# EasyEDA Pro project CH32V307.eprj

# Schematic CH32V307
Board Name: CH32V307; Create Date: 2025-04-24; Page Name: Core; Project Name: CH32V307; Schematic Name: CH32V307; Update Date: 2025-04-25; Company: My Company; Drawed: XIVN1987; Page Size: A4; Version: V1.0
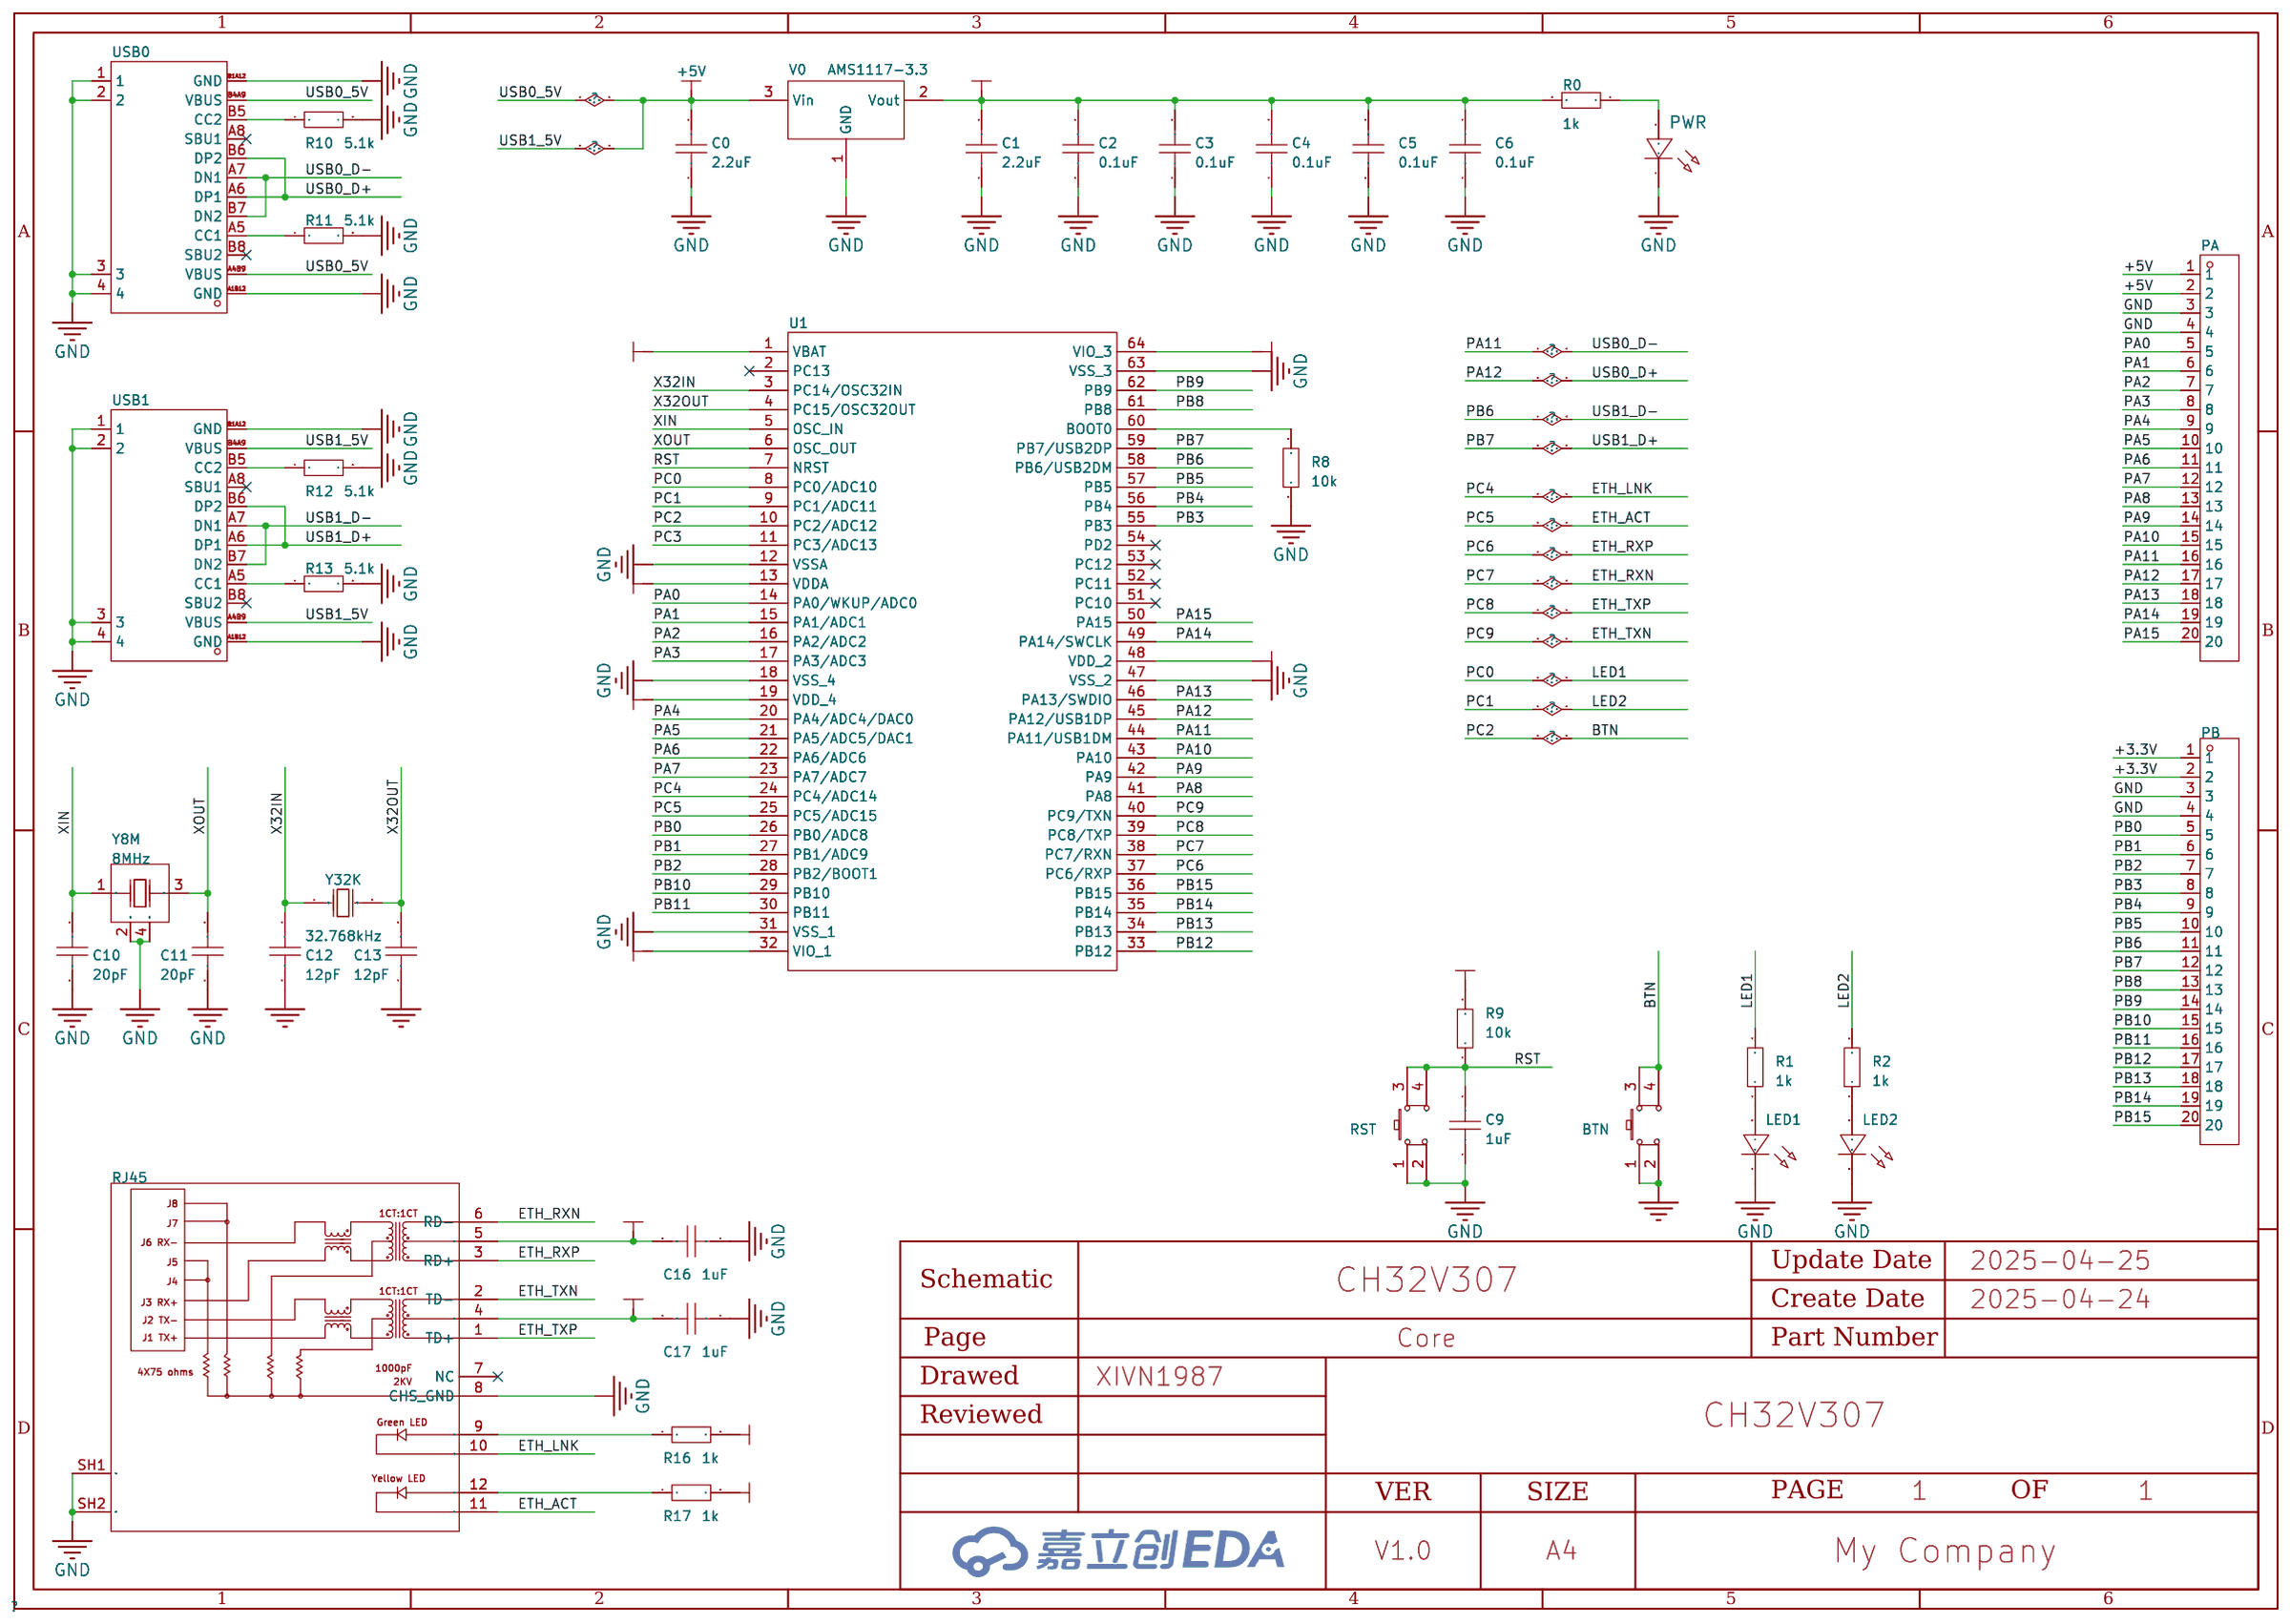
[diagram p0: schematic sheet]

## Parts
BTN  PTS815SJK250SMTRLFS  [SW-SMD_4P-L4.2-W3.3-P2.15-LS5.1]
C0  2.2uF  [C0603]
C1  2.2uF  [C0603]
C2  0.1uF  [C0603]
C3  0.1uF  [C0603]
C4  0.1uF  [C0603]
C5  0.1uF  [C0603]
C6  0.1uF  [C0603]
C9  1uF  [C0603]
C10  20pF  [C0603]
C11  20pF  [C0603]
C12  12pF  [C0603]
C13  12pF  [C0603]
C16  1uF  [C0603]
C17  1uF  [C0603]
LED1  -  [LED0603-RD_BLUE]
LED2  -  [LED0603-RD_BLUE]
PA  -  [HDR-TH_20P-P2.54-V-M-1]
PB  -  [HDR-TH_20P-P2.54-V-M-1]
PWR  -  [LED0603-RD_BLUE]
R0  1k  [R0603]
R1  1k  [R0603]
R2  1k  [R0603]
R8  10k  [R0603]
R9  10k  [R0603]
R10  5.1k  [R0603]
R11  5.1k  [R0603]
R12  5.1k  [R0603]
R13  5.1k  [R0603]
R16  1k  [R0603]
R17  1k  [R0603]
RJ45  HR911105A  [RJ45-TH_HR911105A]
RST  PTS815SJK250SMTRLFS  [SW-SMD_4P-L4.2-W3.3-P2.15-LS5.1]
U1  -  [LQFP-64_L10.0-W10.0-P0.50-LS12.0-TL]
USB0  USB-TYPE-C-017  [USB-TYPE-C-SMD_C9900008089]
USB1  USB-TYPE-C-017  [USB-TYPE-C-SMD_C9900008089]
V0  AMS1117-3.3  [SOT-89-3_L4.5-W2.5-P1.50-LS4.2-BR]
Y8M  8MHz  [OSC-SMD_4P-L3.2-W2.5-BL]
Y32K  32.768kHz  [OSC-SMD_L3.2-W1.5]

## Library data of the parts
BTN RST = PTS815SJK250SMTRLFS: 操作寿命10万次，使用温度-20°C 至 70°C,尺寸4.20mmx3.20mmx2.50mm，操作力度2.5N; LCSC Part Name: 轻触开关; Supplier Part: C918859; Manufacturer: CK; Supplier Footprint: SMD; JLCPCB Part Class: 扩展库; Datasheet: https://atta.szlcsc.com/upload/public/pdf/source/20190916/C411883_4F77F16E1D8E48DC707D8949CEE7CF80.pdf; Supplier: LCSC
C0-C6 C9-C13 C16 C17 = CAP_0603: 容值:100nF;精度:±10%;额定电压:50V;温度系数:X7R;; Supplier Footprint: 0603
LED1 LED2 = LED_0603-B: 照明颜色:蓝色;主波长/色坐标:465~475nm;; Supplier Footprint: 0603; Supplier Part: C72041
PA PB = HDR-M_2.54_1x20P: 间距:2.54mm;总PIN位数:20;排数:1;插针结构:-;行距:-;安装类型:直插;圆针/方针:-;额定电流:-;额定电压:-;配合针长度:-;塑高:-;触头材质:黄铜;触头镀层:-;颜色:黑色;; Supplier Part: C50981; Supplier Footprint: 插件
PWR = LED_0603-R: 发光颜色:红灯;二极管配置:-;透镜颜色:无色透明;主波长:617.5nm;峰值波长:632nm;色温:-;光通量(25时):-;测试电流:5mA;正向电压(VF):2.2V;发光强度:28.5mcd;功率:60mW;发光角度:120°;安装方式:-;工作温度:-40~+85;; Supplier Footprint: 0603; Supplier Part: C72044
R0-R2 R8-R13 R16 R17 = Res_0603: Supplier Footprint: 0603
RJ45 = HR911105A_C12074: 连接器类型:RJ插座;USOC代码:RJ45;端口数量:1;等级:-;屏蔽:-;LED:带LED;; LCSC Part Name: RJ45 带LED; Supplier Part: C12074; Manufacturer: HANRUN(汉仁); Supplier Footprint: 插件; JLCPCB Part Class: 扩展库; Datasheet: https://atta.szlcsc.com/upload/public/pdf/source/20170918/C12074_1505726819496976146.pdf; Supplier: LCSC; Connector Type: RJ插座; Number of Ports: 1; LED: 带LED
U1 = CH32V307RC
USB0 USB1 = USB-TYPE-C-017: 连接器类型:Type-C;标准:-;公母:母座;触点数量:16;端口数量:1;安装方式:卧贴;额定电流 - 电源:3A;工作温度范围:-25~+85;; Supplier Part: C2927037; Manufacturer: DEALON(德艺隆); Supplier Footprint: SMD; JLCPCB Part Class: 扩展库; Datasheet: https://atta.szlcsc.com/upload/public/pdf/source/20211217/653222EE5174722C9DFE2966329956D8.pdf; Supplier: LCSC; Connector Type: Type-C; Gender: 母座; Number of Contacts: 16; Number of Ports: 1; Mounting Style: 卧贴; Current Rating - Power (Max): 3A; Operating Temperature Range: -25~+85
V0 = AMS1117-3.3_SOT-89: 输出类型:-;; Supplier Part: C880752; Manufacturer: Slkor(萨科微); Supplier Footprint: SOT-89-3; JLCPCB Part Class: 扩展库; Datasheet: https://atta.szlcsc.com/upload/public/pdf/source/20201231/C426566_7F22DB93439D00F3FA27143E4F28C6AA.pdf; Supplier: LCSC
Y8M = X322512MSB4SI: 晶振类型:贴片无源晶振;频率:12MHz;频率公差:±10ppm;频率稳定度:±30ppm;负载电容:20pF;工作温度:-40~+85;; LCSC Part Name: 12MHz ±10ppm 20pF; Supplier Part: C9002; Manufacturer: YXC(扬兴晶振); Supplier Footprint: SMD3225-4P; JLCPCB Part Class: 基础库; Datasheet: https://atta.szlcsc.com/upload/public/pdf/source/20210329/C112971_1F611BDC486E193C1706F6D8EB5AA189.pdf; Supplier: LCSC; Crystal Type: 贴片无源晶振; Frequency Tolerance: ±10ppm; Frequency Stability: ±30ppm; Load Capacitance: 20pF; Operating Temperature: -40~+85
Y32K = 7LC32768F12UC: 工作温度:-40~+85;工作温度:-40~+85;频率:32.768kHz;负载电容:12.5pF;晶振类型:贴片无源晶振;频率公差:±20ppm;频率公差:±20ppm;等效串联电阻(ESR):70kΩ;; LCSC Part Name: 32.768KHZ 12.5PF  ±20ppm; Supplier Part: C252398; Manufacturer: SJK(晶科鑫); Supplier Footprint: SMD-3215_2P; JLCPCB Part Class: 扩展库; Datasheet: https://atta.szlcsc.com/upload/public/pdf/source/20180725/C252398_B09721EBC402D2F46F4FCA4EBDD60A31.pdf; Supplier: LCSC; Operating Temperature: -40~+85; Load Capacitance: 12.5pF; Crystal Type: 贴片无源晶振; Frequency Tolerance: ±20ppm; Equivalent Series Resistance (ESR): 70kΩ

## Nets
+3.3V: C1.2 C2.2 C3.2 C4.2 C5.1 C6.1 C16.2 C17.2 PB.1 PB.2 R0.2 R9.2 R16.2 R17.2 RJ45.4 RJ45.5 U1.1(VBAT) U1.13(VDDA) U1.19(VDD_4) U1.32(VIO_1) U1.48(VDD_2) U1.64(VIO_3) V0.2(Vout)
+5V: C0.2 PA.1 PA.2 USB0.A4B9(VBUS) USB0.B4A9(VBUS) USB1.A4B9(VBUS) USB1.B4A9(VBUS) V0.3(Vin)
GND: BTN.1 BTN.2 C0.1 C1.1 C2.1 C3.1 C4.1 C5.2 C6.2 C9.1 C10.2 C11.1 C12.2 C13.1 C16.1 C17.1 LED1.1(C) LED2.1(C) PA.3 PA.4 PB.3 PB.4 PWR.1(C) R8.1 R10.2 R11.2 R12.2 R13.2 RJ45.8(CHS GND) RJ45.SH1 RJ45.SH2 RST.1 RST.2 U1.12(VSSA) U1.18(VSS_4) U1.31(VSS_1) U1.47(VSS_2) U1.63(VSS_3) USB0.1 USB0.2 USB0.3 USB0.4 USB0.A1B12(GND) USB0.B1A12(GND) USB1.1 USB1.2 USB1.3 USB1.4 USB1.A1B12(GND) USB1.B1A12(GND) V0.1(GND) Y8M.2(GND) Y8M.4(GND)
BTN: BTN.3 BTN.4 U1.10(PC2/ADC12)
ETH_ACT: RJ45.11 U1.25(PC5/ADC15)
ETH_LNK: RJ45.10 U1.24(PC4/ADC14)
ETH_RXN: RJ45.6(RD-) U1.38(PC7/RXN)
ETH_RXP: RJ45.3(RD+) U1.37(PC6/RXP)
ETH_TXN: RJ45.2(TD-) U1.40(PC9/TXN)
ETH_TXP: RJ45.1(TD+) U1.39(PC8/TXP)
LED1: R1.2 U1.8(PC0/ADC10)
LED2: R2.2 U1.9(PC1/ADC11)
PA0: PA.5 U1.14(PA0/WKUP/ADC0)
PA1: PA.6 U1.15(PA1/ADC1)
PA2: PA.7 U1.16(PA2/ADC2)
PA3: PA.8 U1.17(PA3/ADC3)
PA4: PA.9 U1.20(PA4/ADC4/DAC0)
PA5: PA.10 U1.21(PA5/ADC5/DAC1)
PA6: PA.11 U1.22(PA6/ADC6)
PA7: PA.12 U1.23(PA7/ADC7)
PA8: PA.13 U1.41(PA8)
PA9: PA.14 U1.42(PA9)
PA10: PA.15 U1.43(PA10)
PA11: PA.16 U1.44(PA11/USB1DM) USB0.A7(DN1) USB0.B7(DN2)
PA12: PA.17 U1.45(PA12/USB1DP) USB0.A6(DP1) USB0.B6(DP2)
PA13: PA.18 U1.46(PA13/SWDIO)
PA14: PA.19 U1.49(PA14/SWCLK)
PA15: PA.20 U1.50(PA15)
PB0: PB.5 U1.26(PB0/ADC8)
PB1: PB.6 U1.27(PB1/ADC9)
PB2: PB.7 U1.28(PB2/BOOT1)
PB3: PB.8 U1.55(PB3)
PB4: PB.9 U1.56(PB4)
PB5: PB.10 U1.57(PB5)
PB6: PB.11 U1.58(PB6/USB2DM) USB1.A7(DN1) USB1.B7(DN2)
PB7: PB.12 U1.59(PB7/USB2DP) USB1.A6(DP1) USB1.B6(DP2)
PB8: PB.13 U1.61(PB8)
PB9: PB.14 U1.62(PB9)
PB10: PB.15 U1.29(PB10)
PB11: PB.16 U1.30(PB11)
PB12: PB.17 U1.33(PB12)
PB13: PB.18 U1.34(PB13)
PB14: PB.19 U1.35(PB14)
PB15: PB.20 U1.36(PB15)
PC3: U1.11(PC3/ADC13)
RST: C9.2 R9.1 RST.3 RST.4 U1.7(NRST)
X32IN: C12.1 U1.3(PC14/OSC32IN) Y32K.1(OSC1)
X32OUT: C13.2 U1.4(PC15/OSC32OUT) Y32K.2(OSC2)
XIN: C10.1 U1.5(OSC_IN) Y8M.1(OSC1)
XOUT: C11.2 U1.6(OSC_OUT) Y8M.3(OSC2)
$1N2870: R11.1 USB0.A5(CC1)
$1N2871: R10.1 USB0.B5(CC2)
$1N2886: PWR.2(A) R0.1
$1N5367: R13.1 USB1.A5(CC1)
$1N5368: R12.1 USB1.B5(CC2)
$1N10227: R8.2 U1.60(BOOT0)
$1N26835: R16.1 RJ45.9
$1N26917: R17.1 RJ45.12
$1N39242: LED2.2(A) R2.1
$1N74940: LED1.2(A) R1.1

Not connected (* = marked no-connect by the designer): RJ45 7(NC)*; U1 2(PC13)* 51(PC10)* 52(PC11)* 53(PC12)* 54(PD2)*; USB0 A8(SBU1)* B8(SBU2)*; USB1 A8(SBU1)* B8(SBU2)*

# Board CH32V307
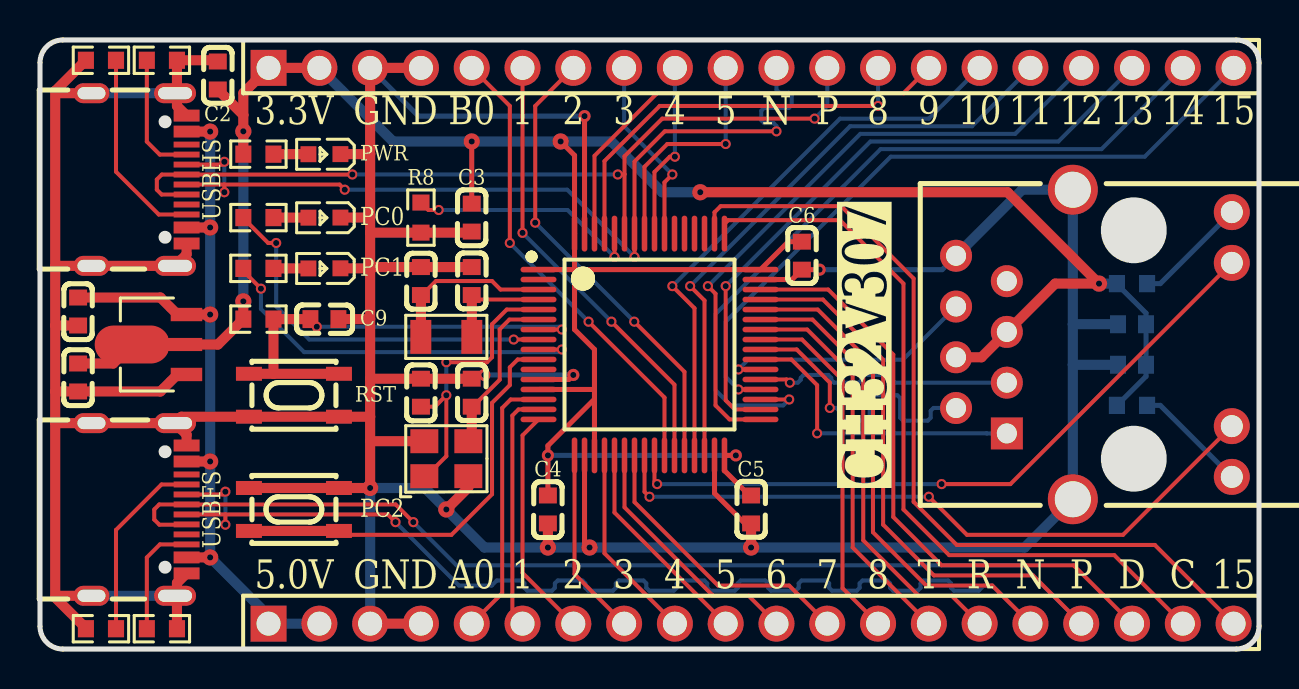
[diagram p1: board, top side]
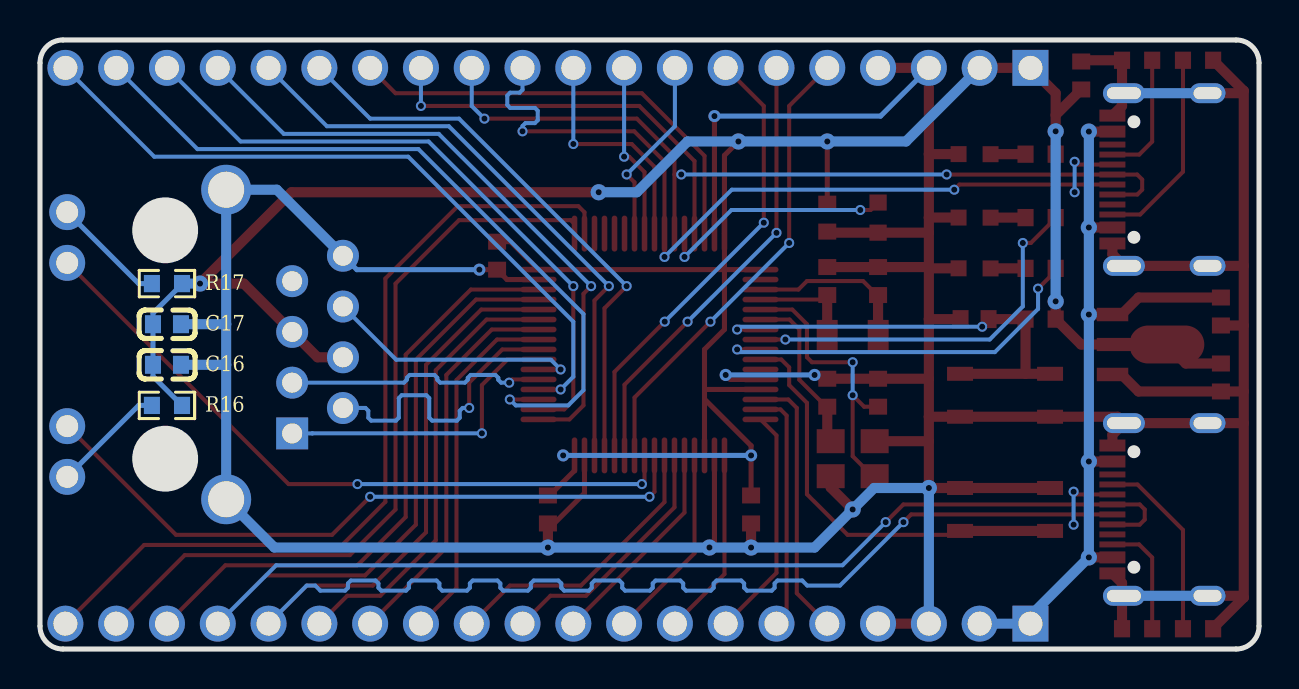
[diagram p2: board, bottom side, seen from below]

Outline 60.96 x 30.48 mm; copper layers: Top Layer, Bottom Layer. Coordinates in mm from the lower left corner of the outline.
Outline path: 0,29.34 0,1.14 arc(0.33,0.33) 1.14,0 59.82,0 arc(60.63,0.33) 60.96,1.14 60.96,29.34 arc(60.63,30.15) 59.82,30.48 1.14,30.48 arc(0.33,30.15) 0,29.34
Stack: Top Layer 0.035mm / Dielectric1 1.51mm FR4 er 4.5 / Bottom Layer 0.035mm

## Design rules (mm)
net PB7: USBHS
net PB6: USBHS
net PA12: USBFS
net PA11: USBFS
net ETH_TXN: ETHTX
net ETH_TXP: ETHTX
net ETH_RXN: ETHRX
net ETH_RXP: ETHRX
spacing safeClearance (default): track to track 0.152, other pairs 0.152 to 0.3
track width trackWidth (default): min 0.127, default 0.254, max 2.54
differential pair differentialPair (default): width min 0.127, default 0.254, max 2.54; gap min 0.152, default 0.152
via viaSize (default): diameter min 0.5, default 0.61, max 10; hole min 0.3, default 0.305, max 6

## Placement (name value [footprint] x y rotation side)
BTN  PTS815SJK250SMTRLFS  [SW-SMD_4P-L4.2-W3.3-P2.15-LS5.1]  12.7 6.98 0 top
C0  2.2uF  [C0603]  1.91 16.89 90 top
C1  2.2uF  [C0603]  1.91 13.59 90 top
C2  0.1uF  [C0603]  8.89 28.7 270 top
C3  0.1uF  [C0603]  21.59 21.59 90 top
C4  0.1uF  [C0603]  25.4 6.98 90 top
C5  0.1uF  [C0603]  35.56 6.98 270 top
C6  0.1uF  [C0603]  38.1 19.69 270 top
C9  1uF  [C0603]  14.22 16.51 180 top
C10  20pF  [C0603]  19.05 12.83 90 top
C11  20pF  [C0603]  21.59 12.83 270 top
C12  12pF  [C0603]  19.05 18.42 90 top
C13  12pF  [C0603]  21.59 18.42 270 top
C16  1uF  [C0603]  54.61 14.22 0 bottom
C17  1uF  [C0603]  54.61 16.26 0 bottom
LED1  -  [LED0603-RD_BLUE]  14.22 21.59 180 top
LED2  -  [LED0603-RD_BLUE]  14.22 19.05 180 top
PA  -  [HDR-TH_20P-P2.54-V-M-1]  35.56 1.27 0 top
PB  -  [HDR-TH_20P-P2.54-V-M-1]  35.56 29.08 0 top
PWR  -  [LED0603-RD_BLUE]  14.22 24.77 180 top
R0  1k  [R0603]  10.92 24.77 180 top
R1  1k  [R0603]  10.92 21.59 180 top
R2  1k  [R0603]  10.92 19.05 180 top
R8  10k  [R0603]  19.05 21.59 90 top
R9  10k  [R0603]  10.92 16.51 180 top
R10  5.1k  [R0603]  6.1 1.02 0 top
R11  5.1k  [R0603]  3.05 1.02 180 top
R12  5.1k  [R0603]  3.05 29.46 180 top
R13  5.1k  [R0603]  6.1 29.46 0 top
R16  1k  [R0603]  54.61 12.19 180 bottom
R17  1k  [R0603]  54.61 18.29 180 bottom
RJ45  HR911105A  [RJ45-TH_HR911105A]  52.71 15.24 90 top
RST  PTS815SJK250SMTRLFS  [SW-SMD_4P-L4.2-W3.3-P2.15-LS5.1]  12.7 12.7 180 top
U1  -  [LQFP-64_L10.0-W10.0-P0.50-LS12.0-TL]  30.48 15.24 0 top
USB0  USB-TYPE-C-017  [USB-TYPE-C-SMD_C9900008089]  4.95 6.98 270 top
USB1  USB-TYPE-C-017  [USB-TYPE-C-SMD_C9900008089]  4.95 23.5 270 top
V0  AMS1117-3.3  [SOT-89-3_L4.5-W2.5-P1.50-LS4.2-BR]  5.97 15.24 0 top
Y8M  8MHz  [OSC-SMD_4P-L3.2-W2.5-BL]  20.32 9.53 0 top
Y32K  32.768kHz  [OSC-SMD_L3.2-W1.5]  20.32 15.62 0 top

## Footprints (pads in the part's own frame, mm; a bottom-side part is the same pattern mirrored in y, then rotated)
C0603
  rect 0.8x0.9 smd: 1(-0.7,0) 2(0.7,0)
HDR-TH_20P-P2.54-V-M-1
  rect 1.801x1.801 hole 1.199: 1(-24.13,0)
  round 1.801 hole 1.199: 2(-21.59,0) 3(-19.05,0) 4(-16.51,0) 5(-13.97,0) 6(-11.43,0) 7(-8.89,0) 8(-6.35,0) 9(-3.81,0) 10(-1.27,0) 11(1.27,0) 12(3.81,0) 13(6.35,0) 14(8.89,0) 15(11.43,0) 16(13.97,0) 17(16.51,0) 18(19.05,0) 19(21.59,0) 20(24.13,0)
LED0603-RD_BLUE
  rect 0.8x0.8 smd: 1(-0.8,-0.003) 2(0.8,0.003)
LQFP-64_L10.0-W10.0-P0.50-LS12.0-TL
  oval 1.801x0.28 smd: 1(-5.55,3.749) 2(-5.55,3.251) 3(-5.55,2.751) 4(-5.55,2.251) 5(-5.55,1.75) 6(-5.55,1.25) 7(-5.55,0.75) 8(-5.55,0.249) 9(-5.55,-0.249) 10(-5.55,-0.75) 11(-5.55,-1.25) 12(-5.55,-1.75) 13(-5.55,-2.251) 14(-5.55,-2.751) 15(-5.55,-3.248) 16(-5.55,-3.749) 33(5.55,-3.749) 34(5.55,-3.248) 35(5.55,-2.751) 36(5.55,-2.251) 37(5.55,-1.75) 38(5.55,-1.25) 39(5.55,-0.75) 40(5.55,-0.249) 41(5.55,0.249) 42(5.55,0.75) 43(5.55,1.25) 44(5.55,1.75) 45(5.55,2.251) 46(5.55,2.751) 47(5.55,3.251) 48(5.55,3.749)
  oval 0.28x1.801 smd: 17(-3.749,-5.55) 18(-3.248,-5.55) 19(-2.751,-5.55) 20(-2.251,-5.55) 21(-1.75,-5.55) 22(-1.25,-5.55) 23(-0.75,-5.55) 24(-0.249,-5.55) 25(0.249,-5.55) 26(0.75,-5.55) 27(1.25,-5.55) 28(1.75,-5.55) 29(2.251,-5.55) 30(2.751,-5.55) 31(3.251,-5.55) 32(3.749,-5.55) 49(3.749,5.55) 50(3.251,5.55) 51(2.751,5.55) 52(2.251,5.55) 53(1.75,5.55) 54(1.25,5.55) 55(0.75,5.55) 56(0.249,5.55) 57(-0.249,5.55) 58(-0.75,5.55) 59(-1.25,5.55) 60(-1.75,5.55) 61(-2.251,5.55) 62(-2.751,5.55) 63(-3.248,5.55) 64(-3.749,5.55)
OSC-SMD_4P-L3.2-W2.5-BL
  rect 1.4x1.2 smd: 1(-1.1,-0.875) 2(1.1,-0.875) 3(1.1,0.875) 4(-1.1,0.875)
OSC-SMD_L3.2-W1.5
  rect 1.049x1.7 smd: 1(-1.275,0) 2(1.275,0)
R0603
  rect 0.806x0.864 smd: 1(-0.753,0) 2(0.753,0)
RJ45-TH_HR911105A
  rect 1.6x1.6 hole 1: 1(-4.45,4.355)
  round 1.6 hole 1: 2(-3.18,6.895) 3(-1.91,4.355) 4(-0.64,6.895) 5(0.63,4.355) 6(1.9,6.895) 7(3.17,4.355) 8(4.44,6.895)
  round 1.8 hole 1.1: 9(-6.625,-6.895) 10(-4.085,-6.895) 11(4.085,-6.895) 12(6.625,-6.895)
  round 2.5 hole 1.8: SH1(-7.745,1.055) SH2(7.745,1.055)
SOT-89-3_L4.5-W2.5-P1.50-LS4.2-BR
  rect 1.575x0.672 smd: 1(1.356,-1.5) 3(1.356,1.5)
  custom 5.377x1.9 smd: 2(-1.356,0)
SW-SMD_4P-L4.2-W3.3-P2.15-LS5.1
  rect 1.3x0.701 smd: 1(-2.251,1.075) 2(2.251,1.075) 3(-2.251,-1.075) 4(2.251,-1.075)
USB-TYPE-C-SMD_C9900008089
  oval 1x2.1 hole 0.6x1.7: 1(-4.32,1.801) 2(4.32,1.801)
  oval 1x1.8 hole 0.6x1.4: 3(-4.32,-2.379) 4(4.32,-2.379)
  rect 0.6x1.3 smd: A1B12(-3.2,2.379) A4B9(-2.4,2.379) B1A12(3.2,2.379) B4A9(2.4,2.379)
  rect 0.3x1.3 smd: A5(-1.25,2.379) A6(-0.25,2.379) A7(0.25,2.379) A8(1.25,2.379) B5(1.75,2.379) B6(0.75,2.379) B7(-0.75,2.379) B8(-1.75,2.379)

## Nets
As in the schematic.

Pads without a net: RJ45 7; U1 2 51 52 53 54; USB0 A8 B8; USB1 A8 B8

## Via types
v1: diameter 0.813, hole 0.305, Top Layer to Bottom Layer, 16 vias
v2: diameter 0.61, hole 0.305, Top Layer to Bottom Layer, 6 vias
v3: diameter 0.508, hole 0.305, Top Layer to Bottom Layer, 46 vias

## Routing (per net, layer and track width the routed paths; a pad name or vN(x,y) marks a point on that pad's centre or on a via; arc(x,y) is an arc through that point)
+3.3V: length 142.5
  Top Layer w0.254: C4.2 v2(25.4,9.69) 25.4,10.18 27.73,12.51 ; C3.2 v1(21.59,25.4) ; 26.73,18.99 U1.48 37.43,20.39 C6.1 ; 26.73,18.99 U1.64 26.73,24.7 v1(26.03,25.4) ; 26.73,18.99 26.73,15.99 27.73,14.99 27.73,12.99 ; 26.73,18.99 U1.1 ; C5.1 35.47,7.69 34.23,8.93 U1.32 v2(34.8,9.69) ; 27.73,12.51 27.73,12.99 ; 27.73,12.51 U1.19 ; 27.73,12.99 U1.13
  Top Layer w0.508: v1(10.17,17.4) R9.2 8.9,15.24 V0.2 3.66,14.29 C1.2 ; 10.17,26.72 C2.2 ; 10.17,26.72 v1(10.17,25.91) R0.2 ; 10.17,26.72 10.17,27.82 PB.1 PB.2 ; v1(33.02,22.86) 48.39,22.86 v1(52.96,18.29) 50.77,18.29 RJ45.5 47.08,14.6 RJ45.4
  Bottom Layer w0.254: R17.2 53.86,18.26 55.31,16.81 C17.2 C16.2 55.31,13.65 R16.2 ; v2(34.8,9.69) v2(25.4,9.69)
  Bottom Layer w0.508: PB.2 17.65,25.4 v1(21.59,25.4) v1(26.03,25.4) 28.57,25.4 31.12,22.86 v1(33.02,22.86) ; v1(10.17,17.4) v1(10.17,25.91) ; R17.2 v1(52.96,18.29)
+5V: length 39.8
  Top Layer w0.508: USB0.A4B9 v1(8.51,9.39) ; v1(8.51,16.74) V0.3 6.87,16.74 6.02,17.59 C0.2 ; USB1.B4A9 v1(8.51,21.09) ; USB0.B4A9 v1(8.51,4.59) ; USB1.A4B9 v1(8.51,25.9)
  Bottom Layer w0.508: v1(8.51,25.9) v1(8.51,21.09) v1(8.51,16.74) v1(8.51,9.39) v1(8.51,4.59) 11.82,1.27 PA.2
GND: length 258.4
  Top Layer w0.254: U1.47 37.61,18.49 C6.2 v2(38.99,18.98) ; U1.18 27.23,5.33 v1(27.48,5.08) ; U1.63 v2(27.23,26.67) ; U1.31 33.73,7.8 35.24,6.29 C5.2 ; v2(22.22,13.72) 21.78,13.72 C11.1 ; v2(26.67,13.72) 26.44,13.49 U1.12
  Top Layer w0.508: C0.1 0.76,16.19 ; 0.76,16.19 0.76,12.89 ; 0.76,16.19 0.76,19.17 ; USB0.4 0.85,2.67 0.76,2.58 ; 0.76,27.93 R12.2 ; 0.76,27.93 0.76,19.17 ; 0.76,27.93 0.88,27.81 USB1.3 ; 0.76,2.58 2.29,1.05 ; 0.76,2.58 0.76,11.31 ; 0.76,19.17 USB1.4 USB1.2 7.33,19.75 USB1.B1A12 ; V0.1 6.87,13.74 6.02,12.89 C1.1 0.76,12.89 ; Y8M.2 21.42,8.09 v1(20.32,6.98) ; C4.1 v1(25.4,5.08) ; 16.51,11.63 16.51,10.4 ; 16.51,11.63 RST.1 RST.2 7.07,11.63 USB0.1 ; 16.51,11.63 16.51,13.53 ; 16.51,10.4 Y8M.4 ; 16.51,10.4 v1(16.51,8.06) BTN.2 BTN.1 ; LED2.1 16.51,19.05 ; 16.51,19.05 16.51,19.12 ; 16.51,19.05 16.51,16.51 ; 16.51,24.77 16.51,21.59 ; 16.51,24.77 PB.3 PB.4 ; 16.51,24.77 PWR.1 ; 16.51,21.59 LED1.1 ; 16.51,21.59 16.51,20.84 ; 16.51,16.51 16.51,13.53 ; 16.51,16.51 C9.1 ; 16.51,13.53 C10.2 C11.1 ; 0.76,12.89 0.76,11.31 ; USB0.1 7.33,10.73 USB0.A1B12 ; USB0.1 USB0.3 0.76,11.31 ; 16.51,19.12 16.51,20.84 ; 16.51,19.12 C12.2 C13.1 ; C2.1 8.83,29.46 R13.2 6.85,27.18 USB1.A1B12 ; 21.59,20.84 R8.1 16.51,20.84 ; R10.2 6.85,3.3 USB0.B1A12 ; C5.2 v1(35.56,5.08) ; PA.3 PA.4
  Bottom Layer w0.254: v2(27.23,26.67) 18.92,26.67 PB.3 ; RJ45.8 45.12,18.98 v2(38.99,18.98) ; v2(22.22,13.72) v2(26.67,13.72)
  Bottom Layer w0.508: 51.65,16.26 51.65,22.98 49.12,22.98 RJ45.8 ; 51.65,16.26 51.65,14.22 ; 51.65,16.26 C17.1 ; 51.65,14.22 RJ45.SH1 49.24,5.08 v1(35.56,5.08) v1(25.4,5.08) 22.22,5.08 v1(20.32,6.98) 19.25,8.06 v1(16.51,8.06) PA.3 ; 51.65,14.22 C16.1 ; USB1.3 USB1.1 ; USB0.4 USB0.2
BTN: length 21.4
  Top Layer w0.203: BTN.4 15.15,5.72 20.57,5.72 22.61,7.75 22.61,12.32 23.5,13.21 23.5,14.1 23.89,14.49 U1.10
  Top Layer w0.508: BTN.3 BTN.4
ETH_ACT: length 34.8
  Top Layer w0.203: v3(30.86,8.26) 30.73,8.39 U1.25 ; RJ45.11 48.53,8.26 v3(45.09,8.26)
  Bottom Layer w0.203: v3(45.09,8.26) v3(30.86,8.26)
ETH_LNK: length 34.3
  Top Layer w0.203: v3(44.45,7.62) 46.35,5.72 54.16,5.72 RJ45.10 ; v3(30.48,7.62) 30.23,7.87 U1.24
  Bottom Layer w0.203: v3(30.48,7.62) v3(44.45,7.62)
ETH_RXN: length 13.3
  Top Layer w0.203: U1.38 v3(34.93,13.99)
  Bottom Layer w0.203: v3(34.93,13.99) 35.41,14.48 43.15,14.48 RJ45.6
ETH_RXP: length 13.3
  Top Layer w0.203: U1.37 37.34,13.49 v3(37.5,13.33)
  Bottom Layer w0.203: RJ45.3 42.76,13.33 42.62,13.47 42.62,13.57 42.47,13.72 41.23,13.72 41.09,13.57 41.09,13.47 40.95,13.33 39.71,13.33 39.57,13.47 39.57,13.57 39.42,13.72 38.19,13.72 38.04,13.57 38.04,13.47 37.9,13.33 v3(37.5,13.33)
ETH_TXN: length 14.9
  Top Layer w0.203: v3(39.5,12.06) 39.5,13.34 37.84,14.99 U1.40
  Bottom Layer w0.203: RJ45.2 45.81,12.06 44.69,12.06 44.54,11.92 44.54,11.57 44.4,11.43 43.16,11.43 43.02,11.57 43.02,12.56 42.87,12.7 41.64,12.7 41.49,12.56 41.49,11.57 41.35,11.43 40.11,11.43 39.97,11.57 39.97,11.92 39.83,12.06 v3(39.5,12.06)
ETH_TXP: length 15.3
  Top Layer w0.203: v3(38.86,10.8) 38.86,13.21 37.58,14.49 U1.39
  Bottom Layer w0.203: RJ45.1 47.35,10.79 47.34,10.8 v3(38.86,10.8)
LED1: length 19.2
  Top Layer w0.203: U1.8 v3(23.69,15.49) ; R1.2 10.17,21.56 11.41,20.32 v3(11.81,20.32)
  Bottom Layer w0.203: v3(11.81,20.32) 11.81,17.15 13.47,15.49 v3(23.69,15.49)
LED2: length 19.6
  Top Layer w0.203: R2.2 10.17,18.91 v3(11.05,18.03) ; U1.9 v3(26.1,14.99)
  Bottom Layer w0.203: v3(26.1,14.99) 25.97,14.86 13.21,14.86 11.05,17.02 v3(11.05,18.03)
PA0: length 13.4
  Top Layer w0.203: U1.14 23.54,12.49 23.11,12.06 23.11,2.79 PA.5
PA1: length 12.1
  Top Layer w0.203: PA.6 23.62,1.78 23.62,11.68 23.93,11.99 U1.15
PA2: length 11.6
  Top Layer w0.203: U1.16 24.13,10.69 24.13,3.81 PA.7
PA3: length 9.4
  Top Layer w0.203: PA.8 26.73,3.75 U1.17
PA4: length 9.9
  Top Layer w0.203: PA.9 28.23,4.79 U1.20
PA5: length 10.7
  Top Layer w0.203: U1.21 28.73,6.83 PA.10
PA6: length 12.6
  Top Layer w0.203: U1.22 29.23,7.09 33.66,2.67 35.43,2.67 PA.11
PA7: length 14.5
  Top Layer w0.203: PA.12 37.47,3.17 33.91,3.17 29.73,7.35 U1.23
PA8: length 17.9
  Top Layer w0.203: U1.41 38.1,15.49 40.13,13.46 40.13,3.05 PA.13
PA9: length 19.6
  Top Layer w0.203: PA.14 40.64,5.08 40.64,13.72 38.37,15.99 U1.42
PA10: length 22.2
  Top Layer w0.203: PA.15 45.59,2.67 43.94,2.67 41.17,5.44 41.17,13.95 38.63,16.49 U1.43
PA11: length 78.8
  Top Layer w0.203: 9.27,6.73 USB0.A7 ; 9.27,6.73 v3(9.27,6.22) ; 9.27,6.73 17.4,6.73 v3(17.78,6.35) ; PA.16 47.62,3.17 44.32,3.17 41.66,5.84 41.66,14.22 38.89,16.99 U1.44 ; USB0.B7 9.13,7.73 v3(9.27,7.87)
  Bottom Layer w0.203: v3(17.78,6.35) 20.96,3.17 22.59,3.17 22.84,3.43 24.08,3.43 24.22,3.29 24.22,3.06 24.37,2.92 25.6,2.92 25.75,3.06 25.75,3.29 25.89,3.43 27.13,3.43 27.27,3.29 27.27,3.06 27.42,2.92 28.65,2.92 28.8,3.06 28.8,3.29 28.94,3.43 30.18,3.43 30.32,3.29 30.32,3.06 30.46,2.92 31.7,2.92 31.84,3.06 31.84,3.29 31.99,3.43 33.22,3.43 33.37,3.29 33.37,3.06 33.51,2.92 34.75,2.92 34.89,3.06 34.89,3.29 35.04,3.43 36.27,3.43 36.42,3.29 36.42,3.06 36.56,2.92 37.8,2.92 37.94,3.06 37.94,3.29 38.08,3.43 39.32,3.43 39.46,3.29 39.46,3.06 39.61,2.92 40.84,2.92 40.99,3.06 40.99,3.29 41.13,3.43 42.37,3.43 42.51,3.29 42.51,3.06 42.66,2.92 43.89,2.92 44.04,3.06 44.04,3.29 44.18,3.43 45.42,3.43 45.56,3.29 45.56,3.06 45.7,2.92 46.94,2.92 47.19,3.17 47.62,3.17 PA.16 ; v3(9.27,7.87) v3(9.27,6.22)
PA12: length 78.8
  Top Layer w0.203: USB0.B6 7.32,6.22 5.97,6.22 5.72,6.48 5.72,6.98 5.97,7.23 USB0.A6 17.78,7.23 v3(18.67,6.35) ; PA.17 49.66,3.68 44.7,3.68 42.16,6.22 42.16,14.48 39.15,17.49 U1.45
  Bottom Layer w0.203: v3(18.67,6.35) 20.83,4.19 49.15,4.19 PA.17
PA13: length 30.3
  Top Layer w0.203: U1.46 39.41,17.99 42.67,14.73 42.67,6.6 45.09,4.19 51.69,4.19 PA.18
PA14: length 38.5
  Top Layer w0.203: PA.19 53.72,4.7 45.47,4.7 43.18,6.98 43.18,18.29 40,21.46 34.42,21.46 34.23,21.28 U1.49
PA15: length 42.4
  Top Layer w0.203: U1.50 33.73,21.86 34.04,22.16 40.07,22.16 43.69,18.54 43.69,7.37 45.85,5.21 55.75,5.21 PA.20
PB0: length 23.4
  Top Layer w0.203: v3(23.5,20.32) 23.5,27.18 PB.5 ; U1.26 31.23,12.59 v3(27.43,16.38)
  Bottom Layer w0.203: v3(23.5,20.32) v3(27.43,16.38)
PB1: length 22.5
  Top Layer w0.203: U1.27 31.73,13.23 v3(28.57,16.38) ; PB.6 v3(24.13,20.83)
  Bottom Layer w0.203: v3(24.13,20.83) v3(28.57,16.38)
PB2: length 23.3
  Top Layer w0.203: U1.28 32.23,13.87 v3(29.72,16.38) ; PB.7 24.76,27.18 v3(24.76,21.34)
  Bottom Layer w0.203: v3(24.76,21.34) v3(29.72,16.38)
PB3: length 9.5
  Top Layer w0.203: U1.55 31.23,23.36 v3(31.62,23.75)
  Bottom Layer w0.203: PB.8 29.21,26.16 v3(31.62,23.75)
PB4: length 8.9
  Top Layer w0.203: U1.56 30.73,23.87 31.5,24.64 v3(31.75,24.64)
  Bottom Layer w0.203: v3(31.75,24.64) PB.9
PB5: length 11.7
  Top Layer w0.203: v3(34.29,25.27) 31.37,25.27 30.23,24.14 U1.57
  Bottom Layer w0.203: v3(34.29,25.27) PB.10
PB6: length 45.9
  Top Layer w0.203: v3(15.24,22.99) 14.98,23.25 9.22,23.25 ; USB1.A7 9.22,23.25 ; 9.22,23.25 v3(9.22,22.86) ; USB1.B7 9.08,24.25 v3(9.22,24.38) ; 29.73,19.69 U1.58 29.73,24.4 31.24,25.91 v3(36.83,25.91)
  Bottom Layer w0.203: v3(9.22,24.38) v3(9.22,22.86) ; PB.11 36.83,27.99 36.97,27.84 37.45,27.84 37.59,27.7 37.59,27.22 37.45,27.08 36.21,27.08 36.07,26.94 36.07,26.46 36.21,26.32 36.69,26.32 36.83,26.17 v3(36.83,25.91) ; v3(29.73,19.62) 26.37,22.99 v3(15.24,22.99)
PB7: length 42.6
  Top Layer w0.203: v3(38.74,26.54) 31.12,26.54 29.23,24.66 29.23,23.75 ; USB1.B6 6.08,22.75 5.84,22.99 5.84,23.5 6.09,23.75 USB1.A6 15.62,23.75 v3(15.62,23.75) ; v3(28.89,23.75) 29.23,23.75 ; 29.23,23.75 U1.59
  Bottom Layer w0.203: v3(38.74,26.54) 39.37,27.18 PB.12 ; v3(15.62,23.75) v3(28.89,23.75)
PB8: length 20.4
  Top Layer w0.203: v3(41.91,27.18) 30.99,27.18 28.23,24.42 U1.61
  Bottom Layer w0.203: PB.13 v3(41.91,27.18)
PB9: length 22.4
  Top Layer w0.203: U1.62 27.73,24.68 30.86,27.81 43.18,27.81 PB.14
PB10: length 28.8
  Top Layer w0.203: U1.29 32.73,17.05 v3(31.62,18.16)
  Bottom Layer w0.203: v3(31.62,18.16) 40,26.54 44.45,26.54 PB.15
PB11: length 30.3
  Top Layer w0.203: U1.30 33.23,17.44 v3(32.51,18.16)
  Bottom Layer w0.203: PB.16 46.61,26.16 40.51,26.16 v3(32.51,18.16)
PB12: length 31.9
  Top Layer w0.203: v3(33.4,18.16) 33.78,17.78 33.78,12.19 34.48,11.49 U1.33
  Bottom Layer w0.203: v3(33.4,18.16) 41.02,25.78 48.77,25.78 PB.17
PB13: length 32.5
  Top Layer w0.203: U1.34 34.74,11.99 34.29,12.45 v3(34.29,18.16)
  Bottom Layer w0.203: v3(34.29,18.16) 41.53,25.4 50.93,25.4 PB.18
PB14: length 37.8
  Top Layer w0.203: U1.35 v3(37.47,12.49)
  Bottom Layer w0.203: v3(37.47,12.49) 37.17,12.19 34.54,12.19 33.78,12.95 33.78,16.76 42.04,25.02 53.09,25.02 PB.19
PB15: length 35.4
  Top Layer w0.203: U1.36 v3(34.93,12.99)
  Bottom Layer w0.203: v3(34.93,12.99) 34.29,13.62 34.29,16.38 42.54,24.64 55.25,24.64 PB.20
RST: length 23.1
  Top Layer w0.203: v3(13.84,16.13) 13.52,16.45 C9.2 ; U1.7 v3(26.1,15.99)
  Top Layer w0.508: RST.4 11.68,13.77 ; 11.68,13.77 R9.1 C9.2 ; 11.68,13.77 RST.3
  Bottom Layer w0.203: v3(26.1,15.99) 25.96,16.13 v3(13.84,16.13)
X32IN: length 8.4
  Top Layer w0.203: U1.3 23.03,17.99 22.61,18.42 19.8,18.42 19.1,17.72 C12.1
  Top Layer w0.508: C12.1 19.05,15.63 Y32K.1
X32OUT: length 5.5
  Top Layer w0.203: U1.4 21.81,17.49 21.59,17.71
  Top Layer w0.508: C13.2 21.59,17.71 Y32K.2
XIN: length 14.4
  Top Layer w0.203: v3(20.32,14.35) 22.35,14.35 22.61,14.61 22.61,16.26 23.34,16.99 U1.5 ; 19.05,12.13 19.75,12.13 v3(20.32,12.7) 20.32,9.65 19.32,8.65 Y8M.1
  Bottom Layer w0.203: v3(20.32,14.35) v3(20.32,12.7)
XOUT: length 8.4
  Top Layer w0.203: 21.59,12.13 21.64,12.13 22.99,13.47 22.99,16 23.47,16.49 U1.6
  Top Layer w0.508: Y8M.3 21.59,10.57 21.59,12.13
$1N2870: length 9.4
  Top Layer w0.203: R11.1 3.8,5.96 6.08,8.23 USB0.A5
$1N2871: length 5.8
  Top Layer w0.203: R10.1 5.34,4.58 6,5.23 USB0.B5
$1N2886: length 1.7
  Top Layer w0.508: R0.1 13.42,24.77 PWR.2
$1N5367: length 6.3
  Top Layer w0.203: R13.1 5.34,25.39 5.99,24.75 USB1.A5
$1N5368: length 10
  Top Layer w0.203: USB1.B5 5.94,21.75 3.8,23.88 R12.1
$1N10227: length 12
  Top Layer w0.203: U1.60 28.73,19.56 ; R8.2 19.42,21.97 v3(19.94,21.97)
  Bottom Layer w0.203: v3(19.94,21.97) 26.38,21.97 v3(28.73,19.62)
$1N26835: length 5.7
  Bottom Layer w0.254: RJ45.9 56.02,12.19 R16.1
$1N26917: length 5.7
  Bottom Layer w0.254: R17.1 56.02,18.29 RJ45.12
$1N39242: length 1.7
  Top Layer w0.508: LED2.2 13.42,19.05 R2.1
$1N74940: length 1.7
  Top Layer w0.508: LED1.2 13.42,21.59 R1.1

## Text on the board
Top Silkscreen Layer: PC0 | PC1 | PC2 | USBHS | USBFS | 3.3V | GND | B0 | 1 | 2 | 3 | 4 | 5 | N | P | 8 | 9 | 10 | 11 | 12 | 13 | 14 | 15 | 5.0V | A0 | 6 | 7 | T | R | D | C | CH32V307
